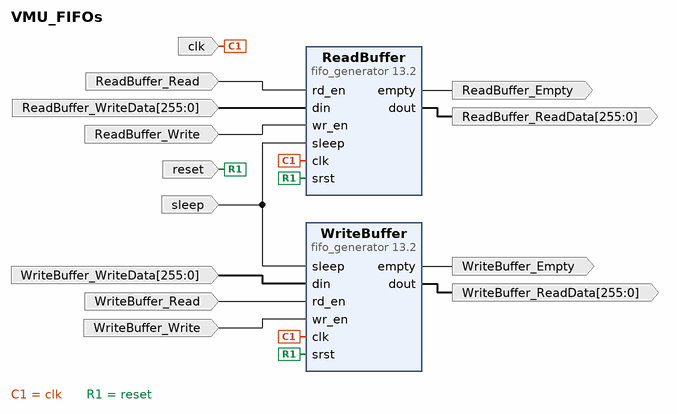
[diagram p0: block diagram of the top level]
# Vivado block design VMU_FIFOs, xcu280-fsvh2892-2L-e, Vivado 2022.1
create_bd_design VMU_FIFOs

create_bd_port -dir I -type clk clk
set_property -dict {CONFIG.ASSOCIATED_RESET reset CONFIG.FREQ_HZ 250000000} [get_bd_ports clk]
create_bd_port -dir I -type rst reset
set_property -dict {CONFIG.POLARITY ACTIVE_HIGH} [get_bd_ports reset]
create_bd_port -dir I sleep
create_bd_port -dir I WriteBuffer_Write
create_bd_port -dir I WriteBuffer_Read
create_bd_port -dir I -from 255 -to 0 -type data WriteBuffer_WriteData
create_bd_port -dir O -from 255 -to 0 -type data WriteBuffer_ReadData
create_bd_port -dir I -from 255 -to 0 ReadBuffer_WriteData
create_bd_port -dir I ReadBuffer_Write
create_bd_port -dir I ReadBuffer_Read
create_bd_port -dir O -from 255 -to 0 ReadBuffer_ReadData
create_bd_port -dir O ReadBuffer_Empty
create_bd_port -dir O WriteBuffer_Empty

create_bd_cell -type ip -vlnv xilinx.com:ip:fifo_generator:13.2 WriteBuffer
set_property -dict [list \
  CONFIG.Input_Data_Width 256 \
  CONFIG.Input_Depth 512 \
  CONFIG.Performance_Options First_Word_Fall_Through \
  CONFIG.Use_Embedded_Registers true \
  CONFIG.dynamic_power_saving true \
] [get_bd_cells WriteBuffer]
create_bd_cell -type ip -vlnv xilinx.com:ip:fifo_generator:13.2 ReadBuffer
set_property -dict [list \
  CONFIG.Input_Data_Width 256 \
  CONFIG.Input_Depth 512 \
  CONFIG.Performance_Options First_Word_Fall_Through \
  CONFIG.Use_Embedded_Registers true \
  CONFIG.dynamic_power_saving true \
] [get_bd_cells ReadBuffer]

# ---- connections ----

connect_bd_net [get_bd_ports ReadBuffer_Read] [get_bd_pins ReadBuffer/rd_en]
connect_bd_net [get_bd_ports ReadBuffer_WriteData] [get_bd_pins ReadBuffer/din]
connect_bd_net [get_bd_ports ReadBuffer_Write] [get_bd_pins ReadBuffer/wr_en]
connect_bd_net [get_bd_pins ReadBuffer/dout] [get_bd_ports ReadBuffer_ReadData]
connect_bd_net [get_bd_pins ReadBuffer/empty] [get_bd_ports ReadBuffer_Empty]
connect_bd_net [get_bd_pins WriteBuffer/empty] [get_bd_ports WriteBuffer_Empty]
connect_bd_net -net WriteData_FIFO_din_1 [get_bd_ports WriteBuffer_WriteData] [get_bd_pins WriteBuffer/din]
connect_bd_net -net WriteData_FIFO_dout1 [get_bd_pins WriteBuffer/dout] [get_bd_ports WriteBuffer_ReadData]
connect_bd_net -net WriteData_FIFO_read_1 [get_bd_ports WriteBuffer_Read] [get_bd_pins WriteBuffer/rd_en]
connect_bd_net -net WriteData_FIFO_write_1 [get_bd_ports WriteBuffer_Write] [get_bd_pins WriteBuffer/wr_en]
connect_bd_net [get_bd_ports clk] [get_bd_pins WriteBuffer/clk] [get_bd_pins ReadBuffer/clk]
connect_bd_net [get_bd_ports reset] [get_bd_pins WriteBuffer/srst] [get_bd_pins ReadBuffer/srst]
connect_bd_net [get_bd_ports sleep] [get_bd_pins WriteBuffer/sleep] [get_bd_pins ReadBuffer/sleep]

validate_bd_design
save_bd_design
